# Altium schematic sheet bms-interface_interface.SchDoc: foxBMS BMS-Master
size A3; DocumentNumber: 21; SheetNumber: 21; SheetTotal: 24; Author: Fraunhofer IISB foxBMS Team; REL-DATE: 2017-05-16; VERSION: 1.0.2; SheetDescription: Interface to BMS-Interface
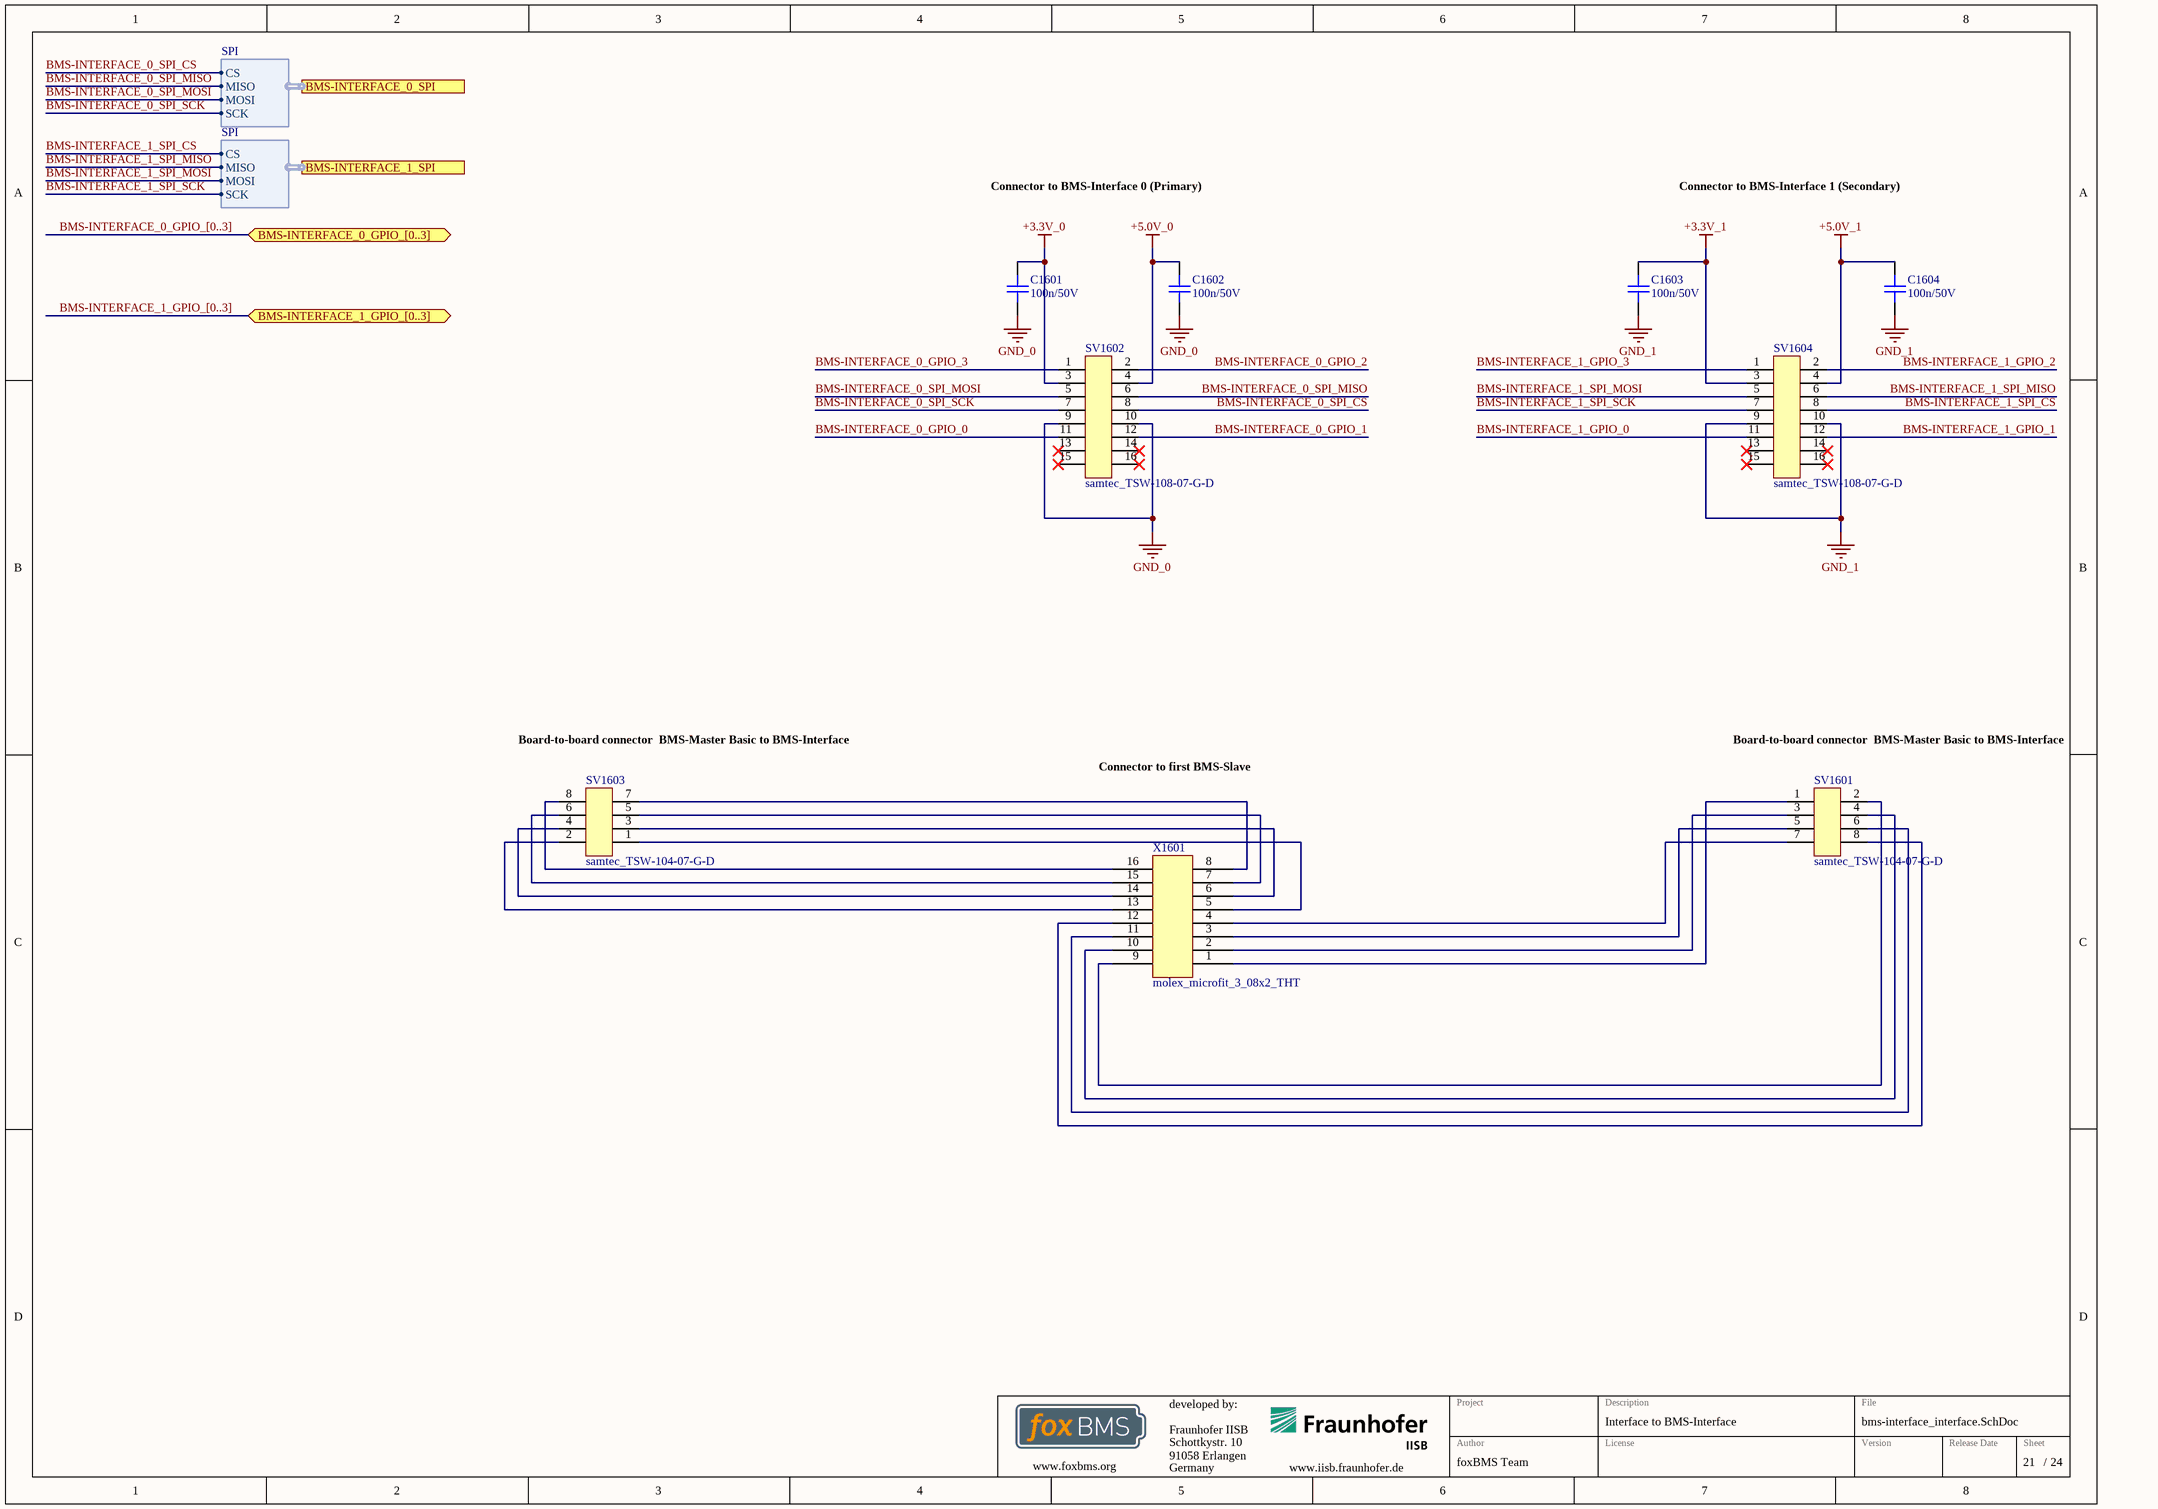
[diagram p0: bms-interface_interface.SchDoc]

## Parts
C1601  100n/50V  [CAPC1608X08N]
C1602  100n/50V  [CAPC1608X08N]
C1603  100n/50V  [CAPC1608X08N]
C1604  100n/50V  [CAPC1608X08N]
SV1601  samtec_TSW-104-07-G-D  [Pinheader_2.54_2x4]
SV1602  samtec_TSW-108-07-G-D  [Pinheader_2.54_2x8]
SV1603  samtec_TSW-104-07-G-D  [Pinheader_2.54_2x4]
SV1604  samtec_TSW-108-07-G-D  [Pinheader_2.54_2x8]
X1601  molex_microfit_3_08x2_THT  [MOLEX_MICROFIT_08x2_THT]

## Ports
BMS-INTERFACE_0_GPIO_[0..3] (bidir), BMS-INTERFACE_0_SPI (harness SPI), BMS-INTERFACE_1_GPIO_[0..3] (bidir), BMS-INTERFACE_1_SPI (harness SPI)

## Harnesses
SPI: CS, MISO, MOSI, SCK

## Nets
+3.3V_0: C1601.1 SV1602.3
+3.3V_1: C1603.1 SV1604.3
+5.0V_0: C1602.1 SV1602.4
+5.0V_1: C1604.1 SV1604.4
GND_0: C1601.2 C1602.2 SV1602.9 SV1602.10
GND_1: C1603.2 C1604.2 SV1604.9 SV1604.10
BMS-INTERFACE_0_GPIO_0: SV1602.11
BMS-INTERFACE_0_GPIO_1: SV1602.12
BMS-INTERFACE_0_GPIO_2: SV1602.2
BMS-INTERFACE_0_GPIO_3: SV1602.1
BMS-INTERFACE_0_SPI_CS: SV1602.8 ; port BMS-INTERFACE_0_SPI.CS
BMS-INTERFACE_0_SPI_MISO: SV1602.6 ; port BMS-INTERFACE_0_SPI.MISO
BMS-INTERFACE_0_SPI_MOSI: SV1602.5 ; port BMS-INTERFACE_0_SPI.MOSI
BMS-INTERFACE_0_SPI_SCK: SV1602.7 ; port BMS-INTERFACE_0_SPI.SCK
BMS-INTERFACE_1_GPIO_0: SV1604.11
BMS-INTERFACE_1_GPIO_1: SV1604.12
BMS-INTERFACE_1_GPIO_2: SV1604.2
BMS-INTERFACE_1_GPIO_3: SV1604.1
BMS-INTERFACE_1_SPI_CS: SV1604.8 ; port BMS-INTERFACE_1_SPI.CS
BMS-INTERFACE_1_SPI_MISO: SV1604.6 ; port BMS-INTERFACE_1_SPI.MISO
BMS-INTERFACE_1_SPI_MOSI: SV1604.5 ; port BMS-INTERFACE_1_SPI.MOSI
BMS-INTERFACE_1_SPI_SCK: SV1604.7 ; port BMS-INTERFACE_1_SPI.SCK
NetSV1601_1: SV1601.1 X1601.1
NetSV1601_2: SV1601.2 X1601.9
NetSV1601_3: SV1601.3 X1601.2
NetSV1601_4: SV1601.4 X1601.10
NetSV1601_5: SV1601.5 X1601.3
NetSV1601_6: SV1601.6 X1601.11
NetSV1601_7: SV1601.7 X1601.4
NetSV1601_8: SV1601.8 X1601.12
NetSV1603_1: SV1603.1 X1601.5
NetSV1603_2: SV1603.2 X1601.13
NetSV1603_3: SV1603.3 X1601.6
NetSV1603_4: SV1603.4 X1601.14
NetSV1603_5: SV1603.5 X1601.7
NetSV1603_6: SV1603.6 X1601.15
NetSV1603_7: SV1603.7 X1601.8
NetSV1603_8: SV1603.8 X1601.16

Not connected (* = marked no-connect by the designer): SV1602 13* 14* 15* 16*; SV1604 13* 14* 15* 16*

## Buses and harness runs
bus BMS-INTERFACE_0_GPIO_[0..3] = port BMS-INTERFACE_0_GPIO_[0..3]
bus BMS-INTERFACE_1_GPIO_[0..3] = port BMS-INTERFACE_1_GPIO_[0..3]

## Notes on the sheet
- Connector to BMS-Interface 0 (Primary)
- Connector to BMS-Interface 1 (Secondary)
- Board-to-board connector
  BMS-Master Basic to BMS-Interface
- Connector to first BMS-Slave
- Fraunhofer IISB
- Schottkystr. 10
- developed by:
- 91058 Erlangen
- Germany
- Author
- Project
- License
- Description
- File
- Version
- Release Date
- Sheet
- www.foxbms.org
- www.iisb.fraunhofer.de
- foxBMS Team
- /

## Library data of the parts
C1601-C1604 = gen_C_ceramic_100n_50V_X7R_0603: MLCC; Capacitance: 100n; Rated Voltage: 50V; Dielectric: X7R; Case EIA: 0603; Case Metric: 1608; PnP Package: C_0603_10; PnP Value: 100n/50V/X7R; PnP equipped: x; Automotive Qualified: False; Part Number: gen_C_ceramic_100n_50V_X7R_0603; Supplier 1: Farnell; Supplier Part Number 1: 2525267; Supplier 2: Digikey; Supplier Part Number 2: 490-6049-1-ND
SV1601 SV1603 = samtec_TSW-104-07-G-D: Board-To-Board Connector, Vertical, 2.54 mm, 8 Contacts, Header, TSW Series, Through Hole, 2 Rows; Manufacturer: Samtec; Circuits: 8; Rated Voltage: 500V AC mated with SSW; Automotive Qualified: False; Part Number: samtec_TSW-104-07-G-D; Part Name: TSW-104-07-G-D; Operating Temperature: -55°C - +125°C; ComponentLink1Description: Datasheet; ComponentLink1URL: http://www.farnell.com/datasheets/1992055.pdf; Supplier 1: Farnell; Supplier Part Number 1: 2025250
SV1602 SV1604 = samtec_TSW-108-07-G-D: Board-To-Board Connector, Vertical, 2.54 mm, 16 Contacts, Header, TSW Series, Through Hole, 2 Rows; Manufacturer: Samtec; Circuits: 16; Rated Voltage: 500V AC mated with SSW; Automotive Qualified: False; Part Number: samtec_TSW-108-07-G-D; Part Name: TSW-108-07-G-D; Operating Temperature: -55°C - +125°C; ComponentLink1Description: Datasheet; ComponentLink1URL: http://www.farnell.com/datasheets/2061825.pdf; Supplier 1: Farnell; Supplier Part Number 1: 2578721
X1601 = molex_microfit_3_08x2_THT: Micro-Fit 3.0 Right Angle Header, 3.00mm Pitch, Dual Row, 16 Circuits, with Snap-in Plastic Peg PCB Lock, Tin, Glow Wire Capable, Black, 43045-1600; Manufacturer: Molex; Circuits: 16; Rated Voltage: 600V; Rated Current: 8.5A; Automotive Qualified: False; Part Number: molex_microfit_3_08x2_THT; Part Name: MicroFit; Operating Temperature: -40°C - +105°C; Supplier 1: Farnell; Supplier Part Number 1: 9961380